# Altium project Steering.PrjPcb (part 1 of 2)
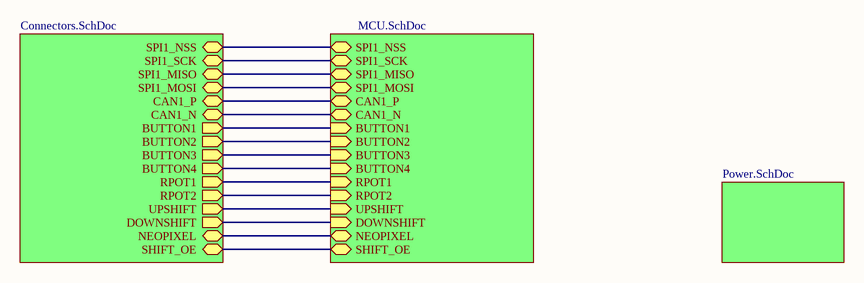
[diagram p0: TOP.SchDoc]
6 sheets, 62 parts. Net scope: hierarchical (ports join the sheet entries above them; power ports are global).
Board file: PCB.pcbdoc
Sheets:
  TOP.SchDoc
    Power = Power.SchDoc
    MCU = MCU.SchDoc
      CAN = CAN.SchDoc
    Connectors = Connectors.SchDoc
      Neopixel = Neopixel.SchDoc

## Sheet TOP.SchDoc: =DocumentName
size A4; Organization: Queen's Formula SAE; Address1: 130 Stuart St, Kingston; Address2: Ontario; Address3: Canada; Address4: K7L 2V9; DocumentNumber: 1; Revision: 0; SheetNumber: 1; SheetTotal: 1

### Sub-sheets
Connectors = Connectors.SchDoc: SPI1_NSS (bidir), SPI1_SCK (bidir), SPI1_MISO (bidir), SPI1_MOSI (bidir), CAN1_P (bidir), CAN1_N (bidir), BUTTON1 (out), BUTTON2 (out), BUTTON3 (out), BUTTON4 (out), RPOT1 (out), RPOT2 (out), UPSHIFT (out), DOWNSHIFT (out), NEOPIXEL (bidir), SHIFT_OE (bidir)
MCU = MCU.SchDoc: SPI1_NSS (bidir), SPI1_SCK (bidir), SPI1_MISO (bidir), SPI1_MOSI (bidir), CAN1_P (bidir), CAN1_N (bidir), BUTTON1 (in), BUTTON2 (in), BUTTON3 (in), BUTTON4 (in), RPOT1 (in), RPOT2 (in), UPSHIFT (in), DOWNSHIFT (in), NEOPIXEL (bidir), SHIFT_OE (bidir)
Power = Power.SchDoc: no entries

### Nets
BUTTON1: sheet MCU/BUTTON1, sheet Connectors/BUTTON1
BUTTON2: sheet MCU/BUTTON2, sheet Connectors/BUTTON2
BUTTON3: sheet MCU/BUTTON3, sheet Connectors/BUTTON3
BUTTON4: sheet MCU/BUTTON4, sheet Connectors/BUTTON4
CAN1_N: sheet MCU/CAN1_N, sheet Connectors/CAN1_N
CAN1_P: sheet MCU/CAN1_P, sheet Connectors/CAN1_P
DOWNSHIFT: sheet MCU/DOWNSHIFT, sheet Connectors/DOWNSHIFT
NEOPIXEL: sheet MCU/NEOPIXEL, sheet Connectors/NEOPIXEL
RPOT1: sheet MCU/RPOT1, sheet Connectors/RPOT1
RPOT2: sheet MCU/RPOT2, sheet Connectors/RPOT2
SHIFT_OE: sheet MCU/SHIFT_OE, sheet Connectors/SHIFT_OE
SPI1_MISO: sheet MCU/SPI1_MISO, sheet Connectors/SPI1_MISO
SPI1_MOSI: sheet MCU/SPI1_MOSI, sheet Connectors/SPI1_MOSI
SPI1_NSS: sheet MCU/SPI1_NSS, sheet Connectors/SPI1_NSS
SPI1_SCK: sheet MCU/SPI1_SCK, sheet Connectors/SPI1_SCK
UPSHIFT: sheet MCU/UPSHIFT, sheet Connectors/UPSHIFT

### Notes on the sheet
- Title
- Size:
- Date:
- A4
- Number:
- Time:
- Revision:
- Sheet
- of
- File:

## Sheet Power.SchDoc: =DocumentName
size A4; Organization: Queen's Formula SAE; Address1: 130 Stuart St, Kingston; Address2: Ontario; Address3: Canada; Address4: K7L 2V9; DocumentNumber: 1; Revision: 0; SheetNumber: 1; SheetTotal: 1
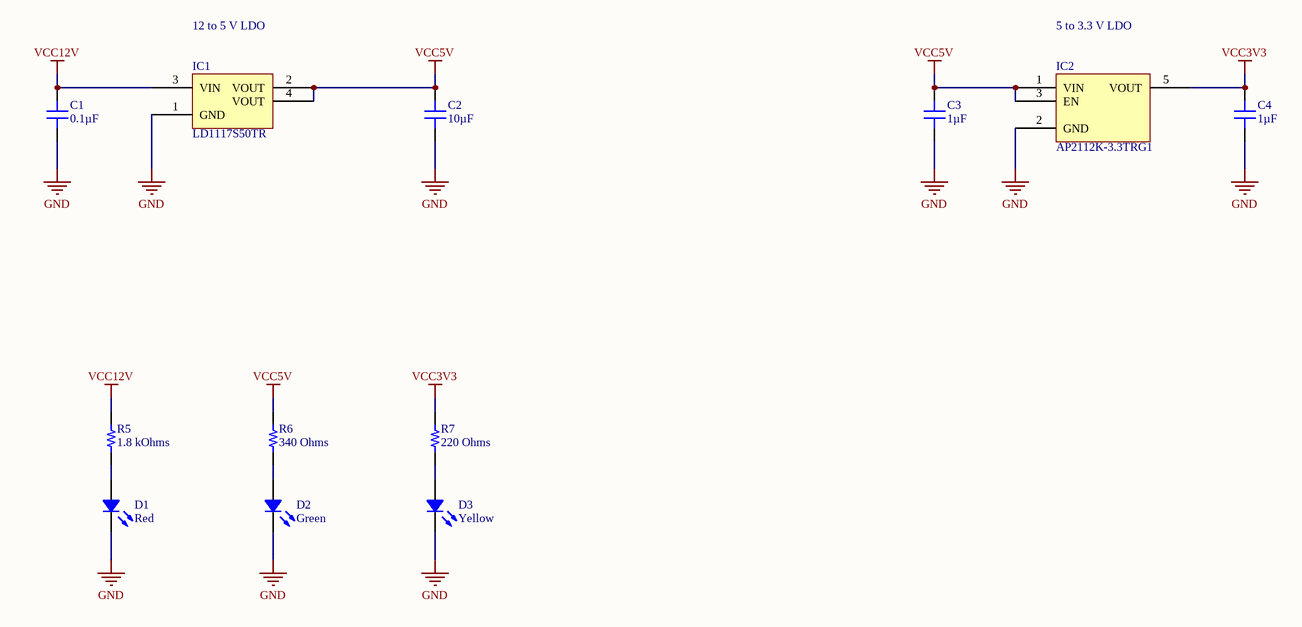
[diagram p1: Power.SchDoc]

### Parts
C1  0.1µF  [CAP 0402_1005]
C2  10µF  [CAP 0805_2012]
C3  1µF  [CAP 0402_1005]
C4  1µF  [CAP 0402_1005]
D1  Red  [LED 0603_1608 RED]
D2  Green  [LED 0402_1005 GREEN]
D3  Yellow  [LED 0402_1005 YELLOW]
IC1  LD1117S50TR  [ST SOT-223]
IC2  AP2112K-3.3TRG1  [DIODES SOT-23-5 W5]
R5  1.8 kOhms  [RES 0402_1005]
R6  340 Ohms  [RES 0402_1005]
R7  220 Ohms  [RES 0402_1005]

### Nets
GND: C1.1 C2.1 C3.1 C4.1 D1.2 D2.2 D3.2 IC1.1(GND) IC2.2(GND)
VCC3V3: C4.2 IC2.5(VOUT) R7.2
VCC5V: C2.2 C3.2 IC1.2(VOUT) IC1.4(VOUT) IC2.1(VIN) IC2.3(EN) R6.2
VCC12V: C1.2 IC1.3(VIN) R5.1
NetD1_1: D1.1 R5.2
NetD2_1: D2.1 R6.1
NetD3_1: D3.1 R7.1

### Notes on the sheet
- 12 to 5 V LDO
- 5 to 3.3 V LDO
- Title
- Size:
- Date:
- A4
- Number:
- Time:
- Revision:
- Sheet
- of
- File:

### Library data of the parts
C1 = CGA2B3X5R1H104M050BB: CAP CER 0.1UF 50V X5R 0402; Manufacturer: TDK Corporation; Tolerance: ±20%; Part Number: CGA2B3X5R1H104M050BB; Value: 0.1µF; Applications: Automotive; Capacitance: 0.1µF; ComponentLink1Description: Datasheet; ComponentLink1URL: https://product.tdk.com/info/en/catalog/datasheets/mlcc_automotive_general_en.pdf?ref_disty=digikey; ComponentLink2Description: DigiKey Link; ComponentLink2URL: http://digikey.com/product-detail/en/tdk-corporation/CGA2B3X5R1H104M050BB/445-12214-1-ND/3953880; Device Package: 0402 (1005 Metric); LastUpdated: 2020-09-02 1:02:25 AM; Lifecycle Status: Active; Minimum Order: 1; Mounting Type: Surface Mount, MLCC; Operating Temperature: -55°C ~ 85°C; Package / Case: 0402 (1005 Metric); Packaging: TapeAndReel; PartId: 1792; Part Status: Active; Price: 0.02; Ratings: AEC-Q200; Series: CGA; Size / Dimension: 0.039" L x 0.020" W (1.00mm x 0.50mm); Supplier 1: DigiKey; Supplier Part Number 1: 445-12214-1-ND; Temperature Coefficient: X5R; Thickness (Max): 0.022" (0.55mm); Voltage - Rated: 50V
C2 = GRM21BC81E106ME51L: CAP CER 10UF 25V X6S 0805; Manufacturer: Murata Electronics; Tolerance: ±20%; Part Number: GRM21BC81E106ME51L; Value: 10µF; Applications: General Purpose; Capacitance: 10µF; ComponentLink1Description: Datasheet; ComponentLink1URL: https://search.murata.co.jp/Ceramy/image/img/A01X/G101/ENG/GRM21BC81E106ME51-01.pdf; ComponentLink2Description: DigiKey Link; ComponentLink2URL: http://digikey.com/product-detail/en/murata-electronics/GRM21BC81E106ME51L/490-10503-1-ND/5026431; Device Package: 0805 (2012 Metric); LastUpdated: 2020-09-02 1:04:38 AM; Lifecycle Status: Active; Minimum Order: 1; Mounting Type: Surface Mount, MLCC; Operating Temperature: -55°C ~ 105°C; Package / Case: 0805 (2012 Metric); Packaging: TapeAndReel; PartId: 4560; Part Status: Active; Price: 0.07; Series: GRM; Size / Dimension: 0.079" L x 0.049" W (2.00mm x 1.25mm); Supplier 1: DigiKey; Supplier Part Number 1: 490-10503-1-ND; Temperature Coefficient: X6S; Thickness (Max): 0.055" (1.40mm); Voltage - Rated: 25V
C3 C4 = 0402ZD105KAT4A: CAP CER 1UF 10V X5R 0402; Manufacturer: AVX Corporation; Tolerance: ±10%; Part Number: 0402ZD105KAT4A; Value: 1µF; Applications: General Purpose; Capacitance: 1µF; ComponentLink1Description: Datasheet; ComponentLink1URL: http://datasheets.avx.com/cx5r.pdf; ComponentLink2Description: DigiKey Link; ComponentLink2URL: http://digikey.com/product-detail/en/avx-corporation/0402ZD105KAT4A/478-10063-1-ND/6564285; Device Package: 0402 (1005 Metric); LastUpdated: 2020-09-02 1:02:25 AM; Lifecycle Status: Active; Minimum Order: 1; Mounting Type: Surface Mount, MLCC; Operating Temperature: -55°C ~ 85°C; Package / Case: 0402 (1005 Metric); Packaging: TapeAndReel; PartId: 1846; Part Status: Active; Price: 0.02; Series: -; Size / Dimension: 0.039" L x 0.020" W (1.00mm x 0.50mm); Supplier 1: DigiKey; Supplier Part Number 1: 478-10063-1-ND; Temperature Coefficient: X5R; Thickness (Max): 0.022" (0.56mm); Voltage - Rated: 10V
D1 = SML-LXIL0603SIC-TR: 1.64X0.84X1.15MM TOP VIEW SMT LE; Manufacturer: Lumex Opto/Components Inc.; Current - Test: 20mA; Lens Color: Colorless; Lens Size: 0.79mm Dia; Lens Style: Round with Domed Top; Lens Transparency: Clear; Millicandela Rating: 1600mcd; Viewing Angle: 75°; Voltage - Forward (Vf) (Typ): 2.1V; Wavelength - Peak: 630nm; Part Number: SML-LXIL0603SIC-TR; Color: Red; ComponentLink1Description: Datasheet; ComponentLink1URL: https://www.lumex.com/spec/SML-LXIL0603SIC-TR.pdf; ComponentLink2Description: DigiKey Link; ComponentLink2URL: http://digikey.com/product-detail/en/lumex-opto-components-inc/SML-LXIL0603SIC-TR/67-2333-1-ND/9866812; Device Package: 0603 (1608 Metric); Height (Max): 1.40mm; LastUpdated: 2020-09-02 1:20:56 AM; Lifecycle Status: Active; Minimum Order: 1; Mounting Type: Surface Mount; Package / Case: 0603 (1608 Metric); Packaging: TapeAndReel; PartId: 406; Part Status: Active; Price: 0.19; Series: -; Size / Dimension: 1.64mm L x 0.84mm W; Supplier 1: DigiKey; Supplier Part Number 1: 67-2333-1-ND; Value: Red
D2 = EAST10052GA0: LED GREEN CLEAR 2SMD; Manufacturer: Everlight Electronics Co Ltd; Configuration: Standard; Current - Test: 5mA; Lens Color: Colorless; Lens Size: 1.00mm x 0.50mm; Lens Style: Rectangle with Flat Top; Viewing Angle: 120°; Voltage - Forward (Vf) (Typ): 2.95V; Wavelength - Peak: 518nm; Part Number: EAST10052GA0; Color: Green; ComponentLink1Description: Datasheet; ComponentLink1URL: https://everlightamericas.com/index.php?controller=attachment&id_attachment=3256; ComponentLink2Description: DigiKey Link; ComponentLink2URL: http://digikey.com/product-detail/en/everlight-electronics-co-ltd/EAST10052GA0/1080-1557-1-ND/8510385; Device Package: 0402 (1005 Metric); Height (Max): 0.25mm; LastUpdated: 2020-09-02 1:20:38 AM; Lens Transparency: Clear; Lifecycle Status: Active; Minimum Order: 1; Mounting Type: Surface Mount; Package / Case: 0402 (1005 Metric); Packaging: TapeAndReel; PartId: 696; Part Status: Active; Price: 0.08; Series: -; Size / Dimension: 1.00mm L x 0.50mm W; Supplier 1: DigiKey; Supplier Part Number 1: 1080-1557-1-ND; Supplier Device Package: 2-SMD; Value: Green
D3 = APG1005SYC-T: LED YELLOW CLEAR CHIP SMD; Manufacturer: Kingbright; Configuration: Standard; Current - Test: 20mA; Lens Color: Colorless; Lens Size: 0.60mm x 0.50mm; Lens Style: Rectangle with Flat Top; Millicandela Rating: 100mcd; Viewing Angle: 120°; Voltage - Forward (Vf) (Typ): 2.05V; Wavelength - Dominant: 589nm; Wavelength - Peak: 591nm; Part Number: APG1005SYC-T; Color: Yellow; ComponentLink1Description: Datasheet; ComponentLink1URL: http://www.kingbrightusa.com/images/catalog/SPEC/APG1005SYC-T.pdf; ComponentLink2Description: DigiKey Link; ComponentLink2URL: http://digikey.com/product-detail/en/kingbright/APG1005SYC-T/754-1809-1-ND/4764945; Device Package: 0402 (1005 Metric); Height (Max): 0.25mm; LastUpdated: 2020-09-02 1:21:13 AM; Lens Transparency: Clear; Lifecycle Status: Active; Minimum Order: 1; Mounting Type: Surface Mount; Package / Case: 0402 (1005 Metric); Packaging: TapeAndReel; PartId: 173; Part Status: Active; Price: 0.10; Series: -; Size / Dimension: 1.00mm L x 0.50mm W; Supplier 1: DigiKey; Supplier Part Number 1: 754-1809-1-ND; Supplier Device Package: Chip LED; Value: Yellow
IC1 = LD1117S50TR: IC REG LINEAR 5V 800MA SOT223; Manufacturer: STMicroelectronics; Current - Quiescent (Iq): 10mA; Number of Regulators: 1; Output Configuration: Positive; Output Type: Fixed; Protection Features: Over Current, Over Temperature; PSRR: 75dB (120Hz); Voltage Dropout (Max): 1.2V @ 800mA; Voltage - Input (Max): 15V; Part Number: LD1117S50TR; ComponentLink1Description: Datasheet; ComponentLink1URL: http://www.st.com/content/ccc/resource/technical/document/datasheet/99/3b/7d/91/91/51/4b/be/CD00000544.pdf/files/CD00000544.pdf/jcr:content/translations/en.CD00000544.pdf; ComponentLink2Description: DigiKey Link; ComponentLink2URL: http://digikey.com/product-detail/en/stmicroelectronics/LD1117S50TR/497-6447-1-ND/1865475; Current - Output: 800mA; LastUpdated: 2020-09-02 1:24:39 AM; Lifecycle Status: Active; Minimum Order: 1; Mounting Type: Surface Mount; Package / Case: TO-261-4, TO-261AA; Packaging: TapeAndReel; Part Status: Active; Price: 0.14; Series: -; Supplier 1: DigiKey; Supplier Part Number 1: 497-6447-1-ND; Supplier Device Package: SOT-223; Voltage - Output (Min/Fixed): 5V
IC2 = AP2112K-3.3TRG1: IC REG LINEAR 3.3V 600MA SOT25; Manufacturer: Diodes Incorporated; Control Features: Enable; Current - Quiescent (Iq): 80µA; Number of Regulators: 1; Output Configuration: Positive; Output Type: Fixed; Protection Features: Over Current, Over Temperature; PSRR: 65sB (100Hz ~ 1KHz); Voltage Dropout (Max): 0.4V @ 600mA; Voltage - Input (Max): 6V; Part Number: AP2112K-3.3TRG1; ComponentLink1Description: Datasheet; ComponentLink1URL: https://www.diodes.com/assets/Datasheets/AP2112.pdf; ComponentLink2Description: DigiKey Link; ComponentLink2URL: http://digikey.com/product-detail/en/diodes-incorporated/AP2112K-3.3TRG1/AP2112K-3.3TRG1DICT-ND/4505257; Current - Output: 600mA; LastUpdated: 2020-09-02 1:25:56 AM; Lifecycle Status: Active; Minimum Order: 1; Mounting Type: Surface Mount; Operating Temperature: -40°C ~ 85°C; Package / Case: SC-74A, SOT-753; Packaging: TapeAndReel; Part Status: Active; Price: 0.10; Series: -; Supplier 1: DigiKey; Supplier Part Number 1: AP2112K-3.3TRG1DICT-ND; Supplier Device Package: SOT-25; Voltage - Output (Min/Fixed): 3.3V
R5 = CR0402-FX-1801GLF: RES SMD 1.8K OHM 1% 1/16W 0402; Manufacturer: Bourns Inc.; Power (Watts): 0.063W, 1/16W; Temperature Coefficient: ±100ppm/°C; Part Number: CR0402-FX-1801GLF; Value: 1.8 kOhms; ComponentLink1Description: Datasheet; ComponentLink1URL: https://www.bourns.com/docs/Product-Datasheets/CR0402.pdf; ComponentLink2Description: DigiKey Link; ComponentLink2URL: http://digikey.com/product-detail/en/bourns-inc/CR0402-FX-1801GLF/CR0402-FX-1801GLFCT-ND/8601850; Composition: Thick Film; Device Package: 0402 (1005 Metric); Height - Seated (Max): 0.016" (0.40mm); LastUpdated: 2020-09-02 1:07:48 AM; Lifecycle Status: Active; Minimum Order: 1; Number of Terminations: 2; Operating Temperature: -55°C ~ 155°C; Package / Case: 0402 (1005 Metric); Packaging: TapeAndReel; PartId: 12865; Part Status: Active; Price: 0.01; Resistance: 1.8 kOhms; Series: CR0402; Size / Dimension: 0.039" L x 0.020" W (1.00mm x 0.50mm); Supplier 1: DigiKey; Supplier Part Number 1: CR0402-FX-1801GLFCT-ND; Supplier Device Package: 0402; Tolerance: ±1%
R6 = ERJ-2RKF3400X: RES SMD 340 OHM 1% 1/10W 0402; Manufacturer: Panasonic Electronic Components; Power (Watts): 0.1W, 1/10W; Temperature Coefficient: ±100ppm/°C; Part Number: ERJ-2RKF3400X; Value: 340 Ohms; ComponentLink1Description: Datasheet; ComponentLink1URL: https://industrial.panasonic.com/cdbs/www-data/pdf/RDA0000/AOA0000C304.pdf; ComponentLink2Description: DigiKey Link; ComponentLink2URL: http://digikey.com/product-detail/en/panasonic-electronic-components/ERJ-2RKF3400X/P340LCT-ND/194355; Composition: Thick Film; Device Package: 0402 (1005 Metric); Features: Automotive AEC-Q200; Height - Seated (Max): 0.016" (0.40mm); LastUpdated: 2020-09-02 1:07:26 AM; Lifecycle Status: Active; Minimum Order: 1; Number of Terminations: 2; Operating Temperature: -55°C ~ 155°C; Package / Case: 0402 (1005 Metric); Packaging: CutTape; PartId: 21290; Part Status: Active; Price: 0.10; Ratings: AEC-Q200; Resistance: 340 Ohms; Series: ERJ; Size / Dimension: 0.039" L x 0.020" W (1.00mm x 0.50mm); Supplier 1: DigiKey; Supplier Part Number 1: P340LCT-ND; Supplier Device Package: 0402; Tolerance: ±1%
R7 = CRGCQ0402J220R: CRGCQ 0402 220R 5%; Manufacturer: TE Connectivity Passive Product; Power (Watts): 0.063W, 1/16W; Temperature Coefficient: ±100ppm/°C; Part Number: CRGCQ0402J220R; Value: 220 Ohms; ComponentLink1Description: Datasheet; ComponentLink1URL: https://www.te.com/commerce/DocumentDelivery/DDEController?Action=srchrtrv&DocNm=1773204-3&DocType=DS&DocLang=English; ComponentLink2Description: DigiKey Link; ComponentLink2URL: http://digikey.com/product-detail/en/te-connectivity-passive-product/CRGCQ0402J220R/A130044CT-ND/8577876; Composition: Thick Film; Device Package: 0402 (1005 Metric); Features: Automotive AEC-Q200, Moisture Resistant; Height - Seated (Max): 0.016" (0.40mm); LastUpdated: 2020-09-02 1:07:58 AM; Lifecycle Status: Active; Minimum Order: 1; Number of Terminations: 2; Operating Temperature: -55°C ~ 155°C; Package / Case: 0402 (1005 Metric); Packaging: CutTape; PartId: 8030; Part Status: Active; Price: 0.10; Ratings: AEC-Q200; Resistance: 220 Ohms; Series: CRGCQ; Size / Dimension: 0.039" L x 0.020" W (1.00mm x 0.50mm); Supplier 1: DigiKey; Supplier Part Number 1: A130044CT-ND; Supplier Device Package: 0402; Tolerance: ±5%

## Sheet MCU.SchDoc: =DocumentName
size A4; Organization: Queen's Formula SAE; Address1: 130 Stuart St, Kingston; Address2: Ontario; Address3: Canada; Address4: K7L 2V9; DocumentNumber: 1; Revision: 0; SheetNumber: 1; SheetTotal: 1
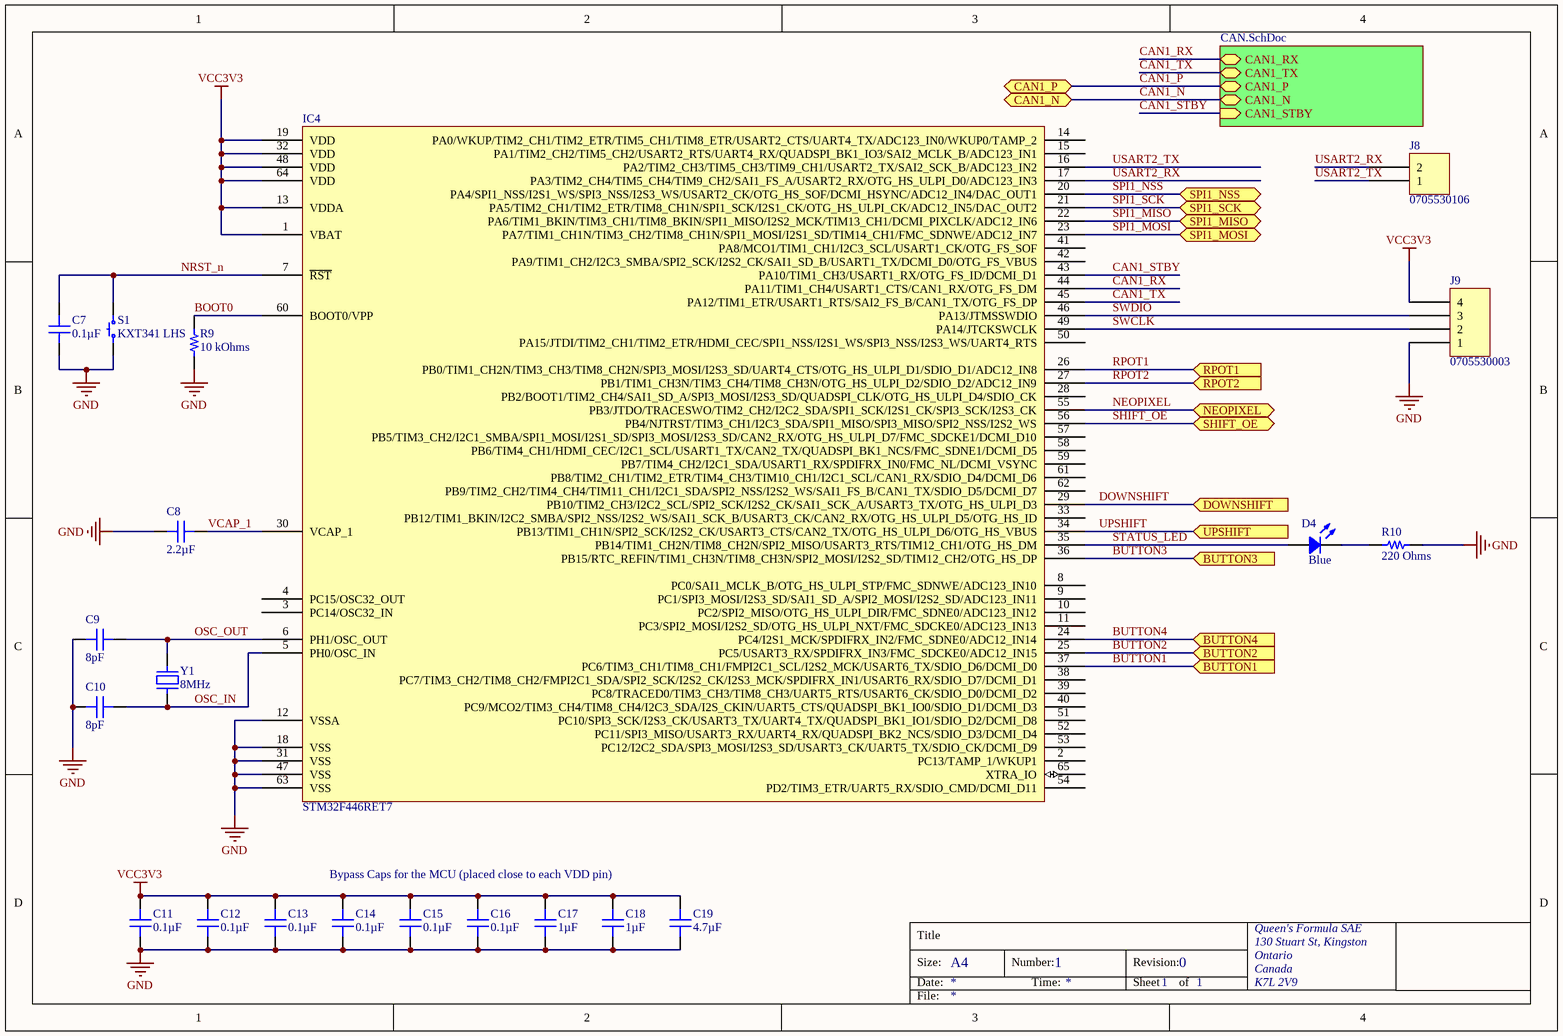
[diagram p2: MCU.SchDoc]

### Parts
C7  0.1µF  [CAP 0402_1005]
C8  2.2µF  [CAP 0402_1005]
C9  8pF  [CAP 0402_1005]
C10  8pF  [CAP 0402_1005]
C11  0.1µF  [CAP 0402_1005]
C12  0.1µF  [CAP 0402_1005]
C13  0.1µF  [CAP 0402_1005]
C14  0.1µF  [CAP 0402_1005]
C15  0.1µF  [CAP 0402_1005]
C16  0.1µF  [CAP 0402_1005]
C17  1µF  [CAP 0402_1005]
C18  1µF  [CAP 0402_1005]
C19  4.7µF  [CAP 0402_1005]
D4  Blue  [LED 0402_1005 BLUE]
IC4  STM32F446RET7  [ST LQFP-64 10X10MM]
J8  0705530106  [MOLEX SDA-70553-2PIN]
J9  0705530003  [MOLEX SDA-70553-4PIN]
R9  10 kOhms  [RES 0402_1005]
R10  220 Ohms  [RES 0402_1005]
S1  KXT341 LHS  [C&K KXT3]
Y1  8MHz  [NDK NX3225GD]

### Sub-sheets
CAN = CAN.SchDoc: CAN1_RX (bidir), CAN1_TX (bidir), CAN1_STBY (in), CAN1_P (bidir), CAN1_N (bidir)

### Ports
BUTTON1 (in), BUTTON2 (in), BUTTON3 (in), BUTTON4 (in), CAN1_N (bidir), CAN1_P (bidir), DOWNSHIFT (in), NEOPIXEL (bidir), RPOT1 (in), RPOT2 (in), SHIFT_OE (bidir), SPI1_MISO (bidir), SPI1_MOSI (bidir), SPI1_NSS (bidir), SPI1_SCK (bidir), UPSHIFT (in)

### Nets
GND: C7.1 C8.2 C9.1 C10.1 C11.1 C12.1 C13.1 C14.1 C15.1 C16.1 C17.1 C18.1 C19.1 IC4.12(VSSA) IC4.18(VSS) IC4.31(VSS) IC4.47(VSS) IC4.63(VSS) J9.1 R9.1 R10.2 S1.1
VCC3V3: C11.2 C12.2 C13.2 C14.2 C15.2 C16.2 C17.2 C18.2 C19.2 IC4.1(VBAT) IC4.13(VDDA) IC4.19(VDD) IC4.32(VDD) IC4.48(VDD) IC4.64(VDD) J9.4
BOOT0: IC4.60(BOOT0/VPP) R9.2
BUTTON1: IC4.37(PC6/TIM3_CH1/TIM8_CH1/FMPI2C1_SCL/I2S2_MCK/USART6_TX/SDIO_D6/DCMI_D0) ; port BUTTON1
BUTTON2: IC4.25(PC5/USART3_RX/SPDIFRX_IN3/FMC_SDCKE0/ADC12_IN15) ; port BUTTON2
BUTTON3: IC4.36(PB15/RTC_REFIN/TIM1_CH3N/TIM8_CH3N/SPI2_MOSI/I2S2_SD/TIM12_CH2/OTG_HS_DP) ; port BUTTON3
BUTTON4: IC4.24(PC4/I2S1_MCK/SPDIFRX_IN2/FMC_SDNE0/ADC12_IN14) ; port BUTTON4
CAN1_N: port CAN1_N, sheet CAN/CAN1_N
CAN1_P: port CAN1_P, sheet CAN/CAN1_P
CAN1_RX: IC4.44(PA11/TIM1_CH4/USART1_CTS/CAN1_RX/OTG_FS_DM) ; sheet CAN/CAN1_RX
CAN1_STBY: IC4.43(PA10/TIM1_CH3/USART1_RX/OTG_FS_ID/DCMI_D1) ; sheet CAN/CAN1_STBY
CAN1_TX: IC4.45(PA12/TIM1_ETR/USART1_RTS/SAI2_FS_B/CAN1_TX/OTG_FS_DP) ; sheet CAN/CAN1_TX
DOWNSHIFT: IC4.29(PB10/TIM2_CH3/I2C2_SCL/SPI2_SCK/I2S2_CK/SAI1_SCK_A/USART3_TX/OTG_HS_ULPI_D3) ; port DOWNSHIFT
NEOPIXEL: IC4.55(PB3/JTDO/TRACESWO/TIM2_CH2/I2C2_SDA/SPI1_SCK/I2S1_CK/SPI3_SCK/I2S3_CK) ; port NEOPIXEL
NRST_n: C7.2 IC4.7(~{RST}) S1.2
OSC_IN: C10.2 IC4.5(PH0/OSC_IN) Y1.1
OSC_OUT: C9.2 IC4.6(PH1/OSC_OUT) Y1.2
RPOT1: IC4.26(PB0/TIM1_CH2N/TIM3_CH3/TIM8_CH2N/SPI3_MOSI/I2S3_SD/UART4_CTS/OTG_HS_ULPI_D1/SDIO_D1/ADC12_IN8) ; port RPOT1
RPOT2: IC4.27(PB1/TIM1_CH3N/TIM3_CH4/TIM8_CH3N/OTG_HS_ULPI_D2/SDIO_D2/ADC12_IN9) ; port RPOT2
SHIFT_OE: IC4.56(PB4/NJTRST/TIM3_CH1/I2C3_SDA/SPI1_MISO/SPI3_MISO/SPI2_NSS/I2S2_WS) ; port SHIFT_OE
SPI1_MISO: IC4.22(PA6/TIM1_BKIN/TIM3_CH1/TIM8_BKIN/SPI1_MISO/I2S2_MCK/TIM13_CH1/DCMI_PIXCLK/ADC12_IN6) ; port SPI1_MISO
SPI1_MOSI: IC4.23(PA7/TIM1_CH1N/TIM3_CH2/TIM8_CH1N/SPI1_MOSI/I2S1_SD/TIM14_CH1/FMC_SDNWE/ADC12_IN7) ; port SPI1_MOSI
SPI1_NSS: IC4.20(PA4/SPI1_NSS/I2S1_WS/SPI3_NSS/I2S3_WS/USART2_CK/OTG_HS_SOF/DCMI_HSYNC/ADC12_IN4/DAC_OUT1) ; port SPI1_NSS
SPI1_SCK: IC4.21(PA5/TIM2_CH1/TIM2_ETR/TIM8_CH1N/SPI1_SCK/I2S1_CK/OTG_HS_ULPI_CK/ADC12_IN5/DAC_OUT2) ; port SPI1_SCK
STATUS_LED: D4.1 IC4.35(PB14/TIM1_CH2N/TIM8_CH2N/SPI2_MISO/USART3_RTS/TIM12_CH1/OTG_HS_DM)
SWCLK: IC4.49(PA14/JTCKSWCLK) J9.2
SWDIO: IC4.46(PA13/JTMSSWDIO) J9.3
UPSHIFT: IC4.34(PB13/TIM1_CH1N/SPI2_SCK/I2S2_CK/USART3_CTS/CAN2_TX/OTG_HS_ULPI_D6/OTG_HS_VBUS) ; port UPSHIFT
USART2_RX: IC4.17(PA3/TIM2_CH4/TIM5_CH4/TIM9_CH2/SAI1_FS_A/USART2_RX/OTG_HS_ULPI_D0/ADC123_IN3) J8.2
USART2_TX: IC4.16(PA2/TIM2_CH3/TIM5_CH3/TIM9_CH1/USART2_TX/SAI2_SCK_B/ADC123_IN2) J8.1
VCAP_1: C8.1 IC4.30(VCAP_1)
NetD4_2: D4.2 R10.1

Not connected (* = marked no-connect by the designer): IC4 2(PC13/TAMP_1/WKUP1) 3(PC14/OSC32_IN) 4(PC15/OSC32_OUT) 8(PC0/SAI1_MCLK_B/OTG_HS_ULPI_STP/FMC_SDNWE/ADC123_IN10) 9(PC1/SPI3_MOSI/I2S3_SD/SAI1_SD_A/SPI2_MOSI/I2S2_SD/ADC123_IN11) 10(PC2/SPI2_MISO/OTG_HS_ULPI_DIR/FMC_SDNE0/ADC123_IN12) 11(PC3/SPI2_MOSI/I2S2_SD/OTG_HS_ULPI_NXT/FMC_SDCKE0/ADC123_IN13) 14(PA0/WKUP/TIM2_CH1/TIM2_ETR/TIM5_CH1/TIM8_ETR/USART2_CTS/UART4_TX/ADC123_IN0/WKUP0/TAMP_2) 15(PA1/TIM2_CH2/TIM5_CH2/USART2_RTS/UART4_RX/QUADSPI_BK1_IO3/SAI2_MCLK_B/ADC123_IN1) 28(PB2/BOOT1/TIM2_CH4/SAI1_SD_A/SPI3_MOSI/I2S3_SD/QUADSPI_CLK/OTG_HS_ULPI_D4/SDIO_CK) 33(PB12/TIM1_BKIN/I2C2_SMBA/SPI2_NSS/I2S2_WS/SAI1_SCK_B/USART3_CK/CAN2_RX/OTG_HS_ULPI_D5/OTG_HS_ID) 38(PC7/TIM3_CH2/TIM8_CH2/FMPI2C1_SDA/SPI2_SCK/I2S2_CK/I2S3_MCK/SPDIFRX_IN1/USART6_RX/SDIO_D7/DCMI_D1) 39(PC8/TRACED0/TIM3_CH3/TIM8_CH3/UART5_RTS/USART6_CK/SDIO_D0/DCMI_D2) 40(PC9/MCO2/TIM3_CH4/TIM8_CH4/I2C3_SDA/I2S_CKIN/UART5_CTS/QUADSPI_BK1_IO0/SDIO_D1/DCMI_D3) 41(PA8/MCO1/TIM1_CH1/I2C3_SCL/USART1_CK/OTG_FS_SOF) 42(PA9/TIM1_CH2/I2C3_SMBA/SPI2_SCK/I2S2_CK/SAI1_SD_B/USART1_TX/DCMI_D0/OTG_FS_VBUS) 50(PA15/JTDI/TIM2_CH1/TIM2_ETR/HDMI_CEC/SPI1_NSS/I2S1_WS/SPI3_NSS/I2S3_WS/UART4_RTS) 51(PC10/SPI3_SCK/I2S3_CK/USART3_TX/UART4_TX/QUADSPI_BK1_IO1/SDIO_D2/DCMI_D8) 52(PC11/SPI3_MISO/USART3_RX/UART4_RX/QUADSPI_BK2_NCS/SDIO_D3/DCMI_D4) 53(PC12/I2C2_SDA/SPI3_MOSI/I2S3_SD/USART3_CK/UART5_TX/SDIO_CK/DCMI_D9) 54(PD2/TIM3_ETR/UART5_RX/SDIO_CMD/DCMI_D11) 57(PB5/TIM3_CH2/I2C1_SMBA/SPI1_MOSI/I2S1_SD/SPI3_MOSI/I2S3_SD/CAN2_RX/OTG_HS_ULPI_D7/FMC_SDCKE1/DCMI_D10) 58(PB6/TIM4_CH1/HDMI_CEC/I2C1_SCL/USART1_TX/CAN2_TX/QUADSPI_BK1_NCS/FMC_SDNE1/DCMI_D5) 59(PB7/TIM4_CH2/I2C1_SDA/USART1_RX/SPDIFRX_IN0/FMC_NL/DCMI_VSYNC) 61(PB8/TIM2_CH1/TIM2_ETR/TIM4_CH3/TIM10_CH1/I2C1_SCL/CAN1_RX/SDIO_D4/DCMI_D6) 62(PB9/TIM2_CH2/TIM4_CH4/TIM11_CH1/I2C1_SDA/SPI2_NSS/I2S2_WS/SAI1_FS_B/CAN1_TX/SDIO_D5/DCMI_D7) 65(XTRA_IO)

### Notes on the sheet
- Bypass Caps for the MCU (placed close to each VDD pin)
- Title
- Size:
- Date:
- A4
- Number:
- Time:
- Revision:
- Sheet
- of
- File:

### Library data of the parts
C7 C11-C16 = C0402C104K4RECAUTO: CAP CER 0402 0.1UF 16V X7R 10%; Manufacturer: KEMET; Part Number: C0402C104K4RECAUTO; Value: 0.1µF; Applications: Automotive, ESD Protection; Capacitance: 0.1µF; ComponentLink1Description: Datasheet; ComponentLink1URL: https://api.kemet.com/component-edge/download/datasheet/C0402C104K4RECAUTO.pdf; ComponentLink2Description: DigiKey Link; ComponentLink2URL: http://digikey.com/product-detail/en/kemet/C0402C104K4RECAUTO/399-17167-1-ND/8563708; Device Package: 0402 (1005 Metric); LastUpdated: 2020-09-02 1:02:25 AM; Lifecycle Status: Active; Minimum Order: 1; Mounting Type: Surface Mount, MLCC; Operating Temperature: -55°C ~ 125°C; Package / Case: 0402 (1005 Metric); Packaging: TapeAndReel; PartId: 1731; Part Status: Active; Price: 0.02; Series: ESD SMD Auto X7R; Size / Dimension: 0.039" L x 0.020" W (1.00mm x 0.50mm); Supplier 1: DigiKey; Supplier Part Number 1: 399-17167-1-ND; Temperature Coefficient: X7R; Thickness (Max): 0.022" (0.55mm); Tolerance: ±10%; Voltage - Rated: 16V; Ratings: AEC-Q200
C8 = CL05A225KO5NQNC: CAP CER 2.2UF 16V X5R 0402; Manufacturer: Samsung Electro-Mechanics; Tolerance: ±10%; Part Number: CL05A225KO5NQNC; Value: 2.2µF; Applications: General Purpose; Capacitance: 2.2µF; ComponentLink1Description: Datasheet; ComponentLink1URL: http://www.samsungsem.com/kr/support/product-search/mlcc/CL05A225KO5NQNC.jsp; ComponentLink2Description: DigiKey Link; ComponentLink2URL: http://digikey.com/product-detail/en/samsung-electro-mechanics/CL05A225KO5NQNC/1276-1461-1-ND/3889547; Device Package: 0402 (1005 Metric); LastUpdated: 2020-09-02 1:02:25 AM; Lifecycle Status: Active; Minimum Order: 1; Mounting Type: Surface Mount, MLCC; Operating Temperature: -55°C ~ 85°C; Package / Case: 0402 (1005 Metric); Packaging: TapeAndReel; PartId: 1761; Part Status: Active; Price: 0.10; Series: CL; Size / Dimension: 0.039" L x 0.020" W (1.00mm x 0.50mm); Supplier 1: DigiKey; Supplier Part Number 1: 1276-1461-1-ND; Temperature Coefficient: X5R; Thickness (Max): 0.022" (0.55mm); Voltage - Rated: 16V
C9 C10 = C1005NP01H080D050BA: CAP CER 8PF 50V NP0 0402; Manufacturer: TDK Corporation; Temperature Coefficient: C0G, NP0; Tolerance: ±0.5pF; Part Number: C1005NP01H080D050BA; Value: 8pF; Applications: General Purpose; Capacitance: 8pF; ComponentLink1Description: Datasheet; ComponentLink1URL: https://product.tdk.com/info/en/catalog/datasheets/mlcc_commercial_hightemp_en.pdf?ref_disty=digikey; ComponentLink2Description: DigiKey Link; ComponentLink2URL: http://digikey.com/product-detail/en/tdk-corporation/C1005NP01H080D050BA/445-13781-1-ND/3955447; Device Package: 0402 (1005 Metric); Features: High Temperature; LastUpdated: 2020-09-02 1:02:24 AM; Lifecycle Status: Active; Minimum Order: 1; Mounting Type: Surface Mount, MLCC; Operating Temperature: -55°C ~ 150°C; Package / Case: 0402 (1005 Metric); Packaging: TapeAndReel; PartId: 2033; Part Status: Active; Price: 0.01; Series: C; Size / Dimension: 0.039" L x 0.020" W (1.00mm x 0.50mm); Supplier 1: DigiKey; Supplier Part Number 1: 445-13781-1-ND; Thickness (Max): 0.022" (0.55mm); Voltage - Rated: 50V
C17 C18 = CGB2A1X5R1A105K033BC: CAP CER 1UF 10V X5R 0402; Manufacturer: TDK Corporation; Tolerance: ±10%; Part Number: CGB2A1X5R1A105K033BC; Value: 1µF; Applications: General Purpose; Capacitance: 1µF; ComponentLink1Description: Datasheet; ComponentLink1URL: https://product.tdk.com/info/en/catalog/datasheets/mlcc_commercial_lowprofile_en.pdf?ref_disty=digikey; ComponentLink2Description: DigiKey Link; ComponentLink2URL: http://digikey.com/product-detail/en/tdk-corporation/CGB2A1X5R1A105K033BC/445-13179-1-ND/3954845; Device Package: 0402 (1005 Metric); LastUpdated: 2020-09-02 1:02:25 AM; Lifecycle Status: Active; Minimum Order: 1; Mounting Type: Surface Mount, MLCC; Operating Temperature: -55°C ~ 85°C; Package / Case: 0402 (1005 Metric); Packaging: TapeAndReel; PartId: 1796; Part Status: Active; Price: 0.02; Series: CGB; Size / Dimension: 0.039" L x 0.020" W (1.00mm x 0.50mm); Supplier 1: DigiKey; Supplier Part Number 1: 445-13179-1-ND; Temperature Coefficient: X5R; Thickness (Max): 0.013" (0.33mm); Voltage - Rated: 10V; Features: Low Profile
C19 = C1005X5R1A475K050BC: CAP CER 4.7UF 10V X5R 0402; Manufacturer: TDK Corporation; Tolerance: ±10%; Part Number: C1005X5R1A475K050BC; Value: 4.7µF; Applications: General Purpose; Capacitance: 4.7µF; ComponentLink1Description: Datasheet; ComponentLink1URL: https://product.tdk.com/info/en/catalog/datasheets/mlcc_commercial_general_en.pdf?ref_disty=digikey; ComponentLink2Description: DigiKey Link; ComponentLink2URL: http://digikey.com/product-detail/en/tdk-corporation/C1005X5R1A475K050BC/445-13820-1-ND/3955486; Device Package: 0402 (1005 Metric); LastUpdated: 2020-09-02 1:02:25 AM; Lifecycle Status: Active; Minimum Order: 1; Mounting Type: Surface Mount, MLCC; Operating Temperature: -55°C ~ 85°C; Package / Case: 0402 (1005 Metric); Packaging: TapeAndReel; PartId: 1759; Part Status: Active; Price: 0.10; Series: C; Size / Dimension: 0.039" L x 0.020" W (1.00mm x 0.50mm); Supplier 1: DigiKey; Supplier Part Number 1: 445-13820-1-ND; Temperature Coefficient: X5R; Thickness (Max): 0.022" (0.55mm); Voltage - Rated: 10V; Features: Low ESL
D4 = APHHS1005QBC/D: LED BLUE CLEAR CHIP SMD; Manufacturer: Kingbright; Configuration: Standard; Current - Test: 20mA; Lens Color: Colorless; Lens Size: 0.80mm x 0.50mm; Lens Style: Rectangle with Flat Top; Millicandela Rating: 60mcd; Viewing Angle: 120°; Voltage - Forward (Vf) (Typ): 3.3V; Wavelength - Dominant: 465nm; Wavelength - Peak: 460nm; Part Number: APHHS1005QBC/D; Color: Blue; ComponentLink1Description: Datasheet; ComponentLink1URL: http://www.kingbrightusa.com/images/catalog/SPEC/APHHS1005QBC-D.pdf; ComponentLink2Description: DigiKey Link; ComponentLink2URL: http://digikey.com/product-detail/en/kingbright/APHHS1005QBC-D/754-1504-1-ND/2263581; Device Package: 0402 (1005 Metric); Height (Max): 0.60mm; LastUpdated: 2020-09-02 1:20:21 AM; Lens Transparency: Clear; Lifecycle Status: Active; Minimum Order: 1; Mounting Type: Surface Mount; Package / Case: 0402 (1005 Metric); Packaging: TapeAndReel; PartId: 862; Part Status: Active; Price: 0.13; Series: -; Size / Dimension: 1.00mm L x 0.50mm W; Supplier 1: DigiKey; Supplier Part Number 1: 754-1504-1-ND; Supplier Device Package: Chip LED; Value: Blue
IC4 = STM32F446RET7: IC MCU 32BIT 512KB FLASH 64LQFP; Manufacturer: STMicroelectronics; Connectivity: CANbus, EBI/EMI, I²C, IrDA, LINbus, SAI, SD, SPDIF-Rx, SPI, UART/USART, USB, USB OTG; Core Processor: ARM® Cortex®-M4; Core Size: 32-Bit; Data Converters: A/D 16x12b; D/A 2x12b; Number of I/O: 50; Oscillator Type: Internal; Peripherals: Brown-out Detect/Reset, DMA, I²S, LVD, POR, PWM, WDT; Program Memory Size: 512KB (512K x 8); RAM Size: 128K x 8; Speed: 180MHz; Voltage - Supply (Vcc/Vdd): 1.7V ~ 3.6V; Part Number: STM32F446RET7; ComponentLink1Description: Datasheet; ComponentLink1URL: http://www.st.com/content/ccc/resource/technical/document/datasheet/65/cb/75/50/53/d6/48/24/DM00141306.pdf/files/DM00141306.pdf/jcr:content/translations/en.DM00141306.pdf; ComponentLink2Description: DigiKey Link; ComponentLink2URL: http://digikey.com/product-detail/en/stmicroelectronics/STM32F446RET7/497-16775-ND/6207480; Device Package: 64-LQFP; LastUpdated: 2020-08-30 9:03:14 PM; Lifecycle Status: Active; Minimum Order: 1; Mounting Type: Surface Mount; Package / Case: 64-LQFP; Packaging: Tray; PartId: 220; Price: 8.42; Program Memory Type: FLASH; Series: STM32F4; Supplier 1: DigiKey; Supplier Part Number 1: 497-16775-ND; Supplier Device Package: 64-LQFP (10x10)
J8 = 0705530106: CONN HEADER R/A 2POS 2.54MM; Manufacturer: Molex; Contact Length - Mating: 0.240" (6.10mm); Contact Length - Post: 0.130" (3.30mm); Material Flammability Rating: UL94 V-0; Number of Positions: 2; Number of Positions Loaded: All; Pitch - Mating: 0.100" (2.54mm); Shrouding: Shrouded - 4 Wall; Style: Board to Cable/Wire; Voltage Rating: 250V; Part Number: 0705530106; ComponentLink1Description: Datasheet; ComponentLink1URL: https://www.molex.com/pdm_docs/sd/705530106_sd.pdf; ComponentLink2Description: DigiKey Link; ComponentLink2URL: http://digikey.com/product-detail/en/molex/0705530106/WM4153-ND/1643386; Connector Type: Header; Contact Finish - Mating: Gold; Contact Finish - Post: Tin; Contact Finish Thickness - Mating: 30.0µin (0.76µm); Contact Material: Phosphor Bronze; Contact Shape: Square; Contact Type: Male Pin; Fastening Type: Latch Holder; Insulation Color: Black; Insulation Height: 0.215" (5.45mm); Insulation Material: Polyester, Glass Filled; LastUpdated: 2020-01-12 11:55:40 PM; Lifecycle Status: Active; Minimum Order: 1; Mounting Type: Through Hole, Right Angle; Number of Rows: 1; Operating Temperature: -40°C ~ 105°C; Packaging: Tube; PartId: 85; Part Status: Active; Price: 1.38; Series: SL 70553; Supplier 1: DigiKey; Supplier Part Number 1: WM4153-ND; Termination: Solder
J9 = 0705530003: CONN HEADER R/A 4POS 2.54MM; Manufacturer: Molex; Contact Length - Mating: 0.240" (6.10mm); Contact Length - Post: 0.130" (3.30mm); Material Flammability Rating: UL94 V-0; Number of Positions: 4; Number of Positions Loaded: All; Pitch - Mating: 0.100" (2.54mm); Shrouding: Shrouded - 4 Wall; Style: Board to Cable/Wire; Voltage Rating: 250V; Part Number: 0705530003; ComponentLink1Description: Datasheet; ComponentLink1URL: https://www.molex.com/pdm_docs/sd/705530002_sd.pdf; ComponentLink2Description: DigiKey Link; ComponentLink2URL: http://digikey.com/product-detail/en/molex/0705530003/WM4902-ND/114959; Connector Type: Header; Contact Finish - Mating: Gold; Contact Finish - Post: Tin; Contact Finish Thickness - Mating: 15.0µin (0.38µm); Contact Material: Phosphor Bronze; Contact Shape: Square; Contact Type: Male Pin; Fastening Type: Latch Holder; Insulation Color: Black; Insulation Height: 0.215" (5.45mm); Insulation Material: Polyester, Glass Filled; LastUpdated: 2020-01-12 11:56:17 PM; Lifecycle Status: Active; Minimum Order: 1; Mounting Type: Through Hole, Right Angle; Number of Rows: 1; Operating Temperature: -40°C ~ 105°C; Packaging: Tube; PartId: 87; Part Status: Active; Price: 1.05; Series: SL 70553; Supplier 1: DigiKey; Supplier Part Number 1: WM4902-ND; Termination: Solder
R9 = CRCW040210K0DHEDP: RES SMD 10K OHM 0.5% 1/16W 0402; Manufacturer: Vishay Dale; Power (Watts): 0.063W, 1/16W; Temperature Coefficient: ±50ppm/°C; Part Number: CRCW040210K0DHEDP; Value: 10 kOhms; ComponentLink1Description: Datasheet; ComponentLink1URL: http://www.vishay.com/docs/20036/dcrcwpe3.pdf; ComponentLink2Description: DigiKey Link; ComponentLink2URL: http://digikey.com/product-detail/en/vishay-dale/CRCW040210K0DHEDP/541-10KAVCT-ND/3593906; Composition: Thick Film; Device Package: 0402 (1005 Metric); Height - Seated (Max): 0.016" (0.40mm); LastUpdated: 2020-09-02 1:08:05 AM; Lifecycle Status: Active; Minimum Order: 1; Number of Terminations: 2; Operating Temperature: -55°C ~ 155°C; Package / Case: 0402 (1005 Metric); Packaging: TapeAndReel; PartId: 5057; Part Status: Active; Price: 0.03; Resistance: 10 kOhms; Series: CRCW-P; Size / Dimension: 0.039" L x 0.020" W (1.00mm x 0.50mm); Supplier 1: DigiKey; Supplier Part Number 1: 541-10KAVCT-ND; Supplier Device Package: 0402; Tolerance: ±0.5%; Features: Automotive AEC-Q200; Ratings: AEC-Q200
R10 = CRGCQ0402J220R: as R7 on sheet Power; Part Number: CRGCQ0402J220R; Value: 220 Ohms; ComponentLink1Description: Datasheet; ComponentLink1URL: https://www.te.com/commerce/DocumentDelivery/DDEController?Action=srchrtrv&DocNm=1773204-3&DocType=DS&DocLang=English; ComponentLink2Description: DigiKey Link; ComponentLink2URL: http://digikey.com/product-detail/en/te-connectivity-passive-product/CRGCQ0402J220R/A130044CT-ND/8577876; Composition: Thick Film; Device Package: 0402 (1005 Metric); Features: Automotive AEC-Q200, Moisture Resistant; Height - Seated (Max): 0.016" (0.40mm); LastUpdated: 2020-09-02 1:07:58 AM; Lifecycle Status: Active; Minimum Order: 1; Number of Terminations: 2; Operating Temperature: -55°C ~ 155°C; Package / Case: 0402 (1005 Metric); Packaging: CutTape; PartId: 8030; Part Status: Active; Price: 0.10; Ratings: AEC-Q200; Resistance: 220 Ohms; Series: CRGCQ; Size / Dimension: 0.039" L x 0.020" W (1.00mm x 0.50mm); Supplier 1: DigiKey; Supplier Part Number 1: A130044CT-ND; Supplier Device Package: 0402; Tolerance: ±5%
S1 = KXT341 LHS: SWITCH TACTILE SPST-NO 0.02A 15V; Manufacturer: C&K; Actuator Height off PCB, Vertical: 0.60mm; Actuator Orientation: Top Actuated; Actuator Type: Standard; Contact Rating @ Voltage: 0.02A @ 15VDC; Illumination: Non-Illuminated; Operating Force: 330gf; Outline: 3.00mm x 2.00mm; Switch Function: Off-Mom; Part Number: KXT341 LHS; Circuit: SPST-NO; ComponentLink1Description: Datasheet; ComponentLink1URL: https://dznh3ojzb2azq.cloudfront.net/products/Tactile/KXT3/documents/datasheet.pdf; ComponentLink2Description: DigiKey Link; ComponentLink2URL: http://digikey.com/product-detail/en/c-k/KXT341-LHS/CKN10781CT-ND/6607324; LastUpdated: 2020-09-02 1:27:07 AM; Lifecycle Status: Active; Minimum Order: 1; Mounting Type: Surface Mount; Operating Temperature: -40°C ~ 85°C; Packaging: TapeAndReel; Part Status: Active; Price: 0.14; Series: KXT3; Supplier 1: DigiKey; Supplier Part Number 1: CKN10781CT-ND; Termination Style: SMD (SMT) Tab
Y1 = NX3225GD-8MHZ-STD-CRA-3: CRYSTAL 8.0000MHZ 8PF SMD; Manufacturer: NDK America, Inc.; ESR (Equivalent Series Resistance): 500 Ohms; Frequency Stability: ±150ppm; Frequency Tolerance: ±50ppm; Operating Mode: Fundamental; Part Number: NX3225GD-8MHZ-STD-CRA-3; ComponentLink1Description: Datasheet; ComponentLink1URL: http://www.ndk.com/images/products/catalog/c_NX3225GD-STD-CRA-3_e.pdf; ComponentLink2Description: DigiKey Link; ComponentLink2URL: http://digikey.com/product-detail/en/ndk-america-inc/NX3225GD-8MHZ-STD-CRA-3/644-1178-1-ND/3125567; Frequency: 8MHz; Height - Seated (Max): 0.039" (1.00mm); LastUpdated: 2020-09-02 1:25:56 AM; Lifecycle Status: Active; Load Capacitance: 8pF; Minimum Order: 1; Mounting Type: Surface Mount; Operating Temperature: -40°C ~ 150°C; Package / Case: 2-SMD, No Lead; Packaging: TapeAndReel; PartId: 744; Part Status: Active; Price: 0.48; Ratings: AEC-Q200; Series: NX3225GD; Size / Dimension: 0.126" L x 0.098" W (3.20mm x 2.50mm); Supplier 1: DigiKey; Supplier Part Number 1: 644-1178-1-ND; Type: MHz Crystal; Value: 8MHz

## Sheet CAN.SchDoc: =DocumentName
size A4; Organization: Queen's Formula SAE; Address1: 130 Stuart St, Kingston; Address2: Ontario; Address3: Canada; Address4: K7L 2V9; DocumentNumber: 1; Revision: 0; SheetNumber: 1; SheetTotal: 1
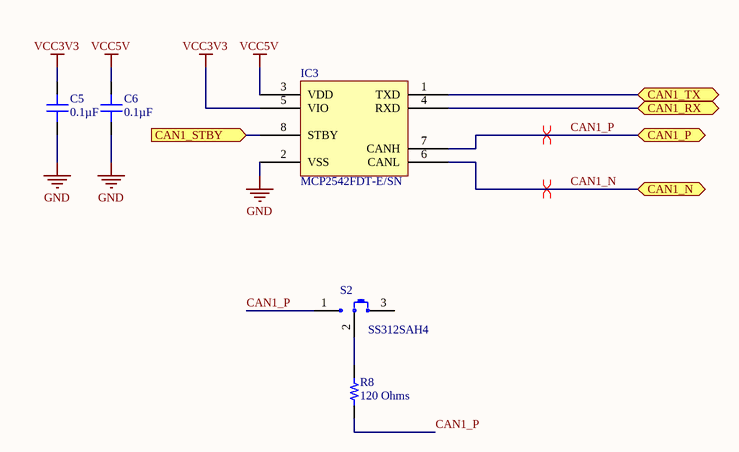
[diagram p3: CAN.SchDoc]

### Parts
C5  0.1µF  [CAP 0201_0603]
C6  0.1µF  [CAP 0201_0603]
IC3  MCP2542FDT-E/SN  [MICROCHIP SOIC-8 150MIL WIDE]
R8  120 Ohms  [RES 0402_1005]
S2  SS312SAH4  [NKK SS312SAH4]

### Ports
CAN1_N (bidir), CAN1_P (bidir), CAN1_RX (bidir), CAN1_STBY (in), CAN1_TX (bidir)

### Nets
GND: C5.1 C6.1 IC3.2(VSS)
VCC3V3: C5.2 IC3.5(VIO)
VCC5V: C6.2 IC3.3(VDD)
CAN1_N: IC3.6(CANL) ; port CAN1_N
CAN1_P: IC3.7(CANH) R8.1 S2.1 ; port CAN1_P
CAN1_RX: IC3.4(RXD) ; port CAN1_RX
CAN1_STBY: IC3.8(STBY) ; port CAN1_STBY
CAN1_TX: IC3.1(TXD) ; port CAN1_TX
NetR8_2: R8.2 S2.2(COM)

Not connected (* = marked no-connect by the designer): S2 3

### Layout directives
differential pair: CAN1_N, CAN1_P

### Notes on the sheet
- Title
- Size:
- Date:
- A4
- Number:
- Time:
- Revision:
- Sheet
- of
- File:

### Library data of the parts
C5 C6 = EMK063BJ104KP-F: CAP CER 0.1UF 16V X5R 0201; Manufacturer: Taiyo Yuden; Tolerance: ±10%; Part Number: EMK063BJ104KP-F; Value: 0.1µF; Applications: General Purpose; Capacitance: 0.1µF; ComponentLink1Description: Datasheet; ComponentLink1URL: https://ds.yuden.co.jp/TYCOMPAS/ut/detail?pn=EMK063BJ104KP-F  &u=M; ComponentLink2Description: DigiKey Link; ComponentLink2URL: http://digikey.com/product-detail/en/taiyo-yuden/EMK063BJ104KP-F/587-5833-1-ND/7674954; Device Package: 0201 (0603 Metric); LastUpdated: 2020-09-02 1:00:18 AM; Lifecycle Status: Active; Minimum Order: 1; Mounting Type: Surface Mount, MLCC; Operating Temperature: -55°C ~ 85°C; Package / Case: 0201 (0603 Metric); Packaging: TapeAndReel; PartId: 12; Part Status: Active; Price: 0.02; Series: M; Size / Dimension: 0.024" L x 0.012" W (0.60mm x 0.30mm); Supplier 1: DigiKey; Supplier Part Number 1: 587-5833-1-ND; Temperature Coefficient: X5R; Thickness (Max): 0.013" (0.33mm); Voltage - Rated: 16V
IC3 = MCP2542FDT-E/SN: IC TRANSCEIVER 1/1 8SOIC; Manufacturer: Microchip Technology; Data Rate: 8Mbps; Protocol: CANbus; Receiver Hysteresis: 200mV; Voltage - Supply: 4.5V ~ 5.5V; Part Number: MCP2542FDT-E/SN; ComponentLink1Description: Datasheet; ComponentLink1URL: http://www.microchip.com/mymicrochip/filehandler.aspx?ddocname=en585412; ComponentLink2Description: DigiKey Link; ComponentLink2URL: http://digikey.com/product-detail/en/microchip-technology/MCP2542FDT-E-SN/MCP2542FDT-E-SNCT-ND/9642863; Device Package: 8-SOIC (0.154", 3.90mm Width); LastUpdated: 2020-05-24 11:07:13 PM; Lifecycle Status: Active; Minimum Order: 1; Mounting Type: Surface Mount; Number of Drivers/Receivers: 1/1; Operating Temperature: -40°C ~ 125°C; Package / Case: 8-SOIC (0.154", 3.90mm Width); Packaging: TapeAndReel; Part Status: Active; Price: 0.59; Series: -; Supplier 1: DigiKey; Supplier Part Number 1: MCP2542FDT-E/SNCT-ND; Supplier Device Package: 8-SOIC; Type: Transceiver
R8 = RC0402JR-07120RL: RES SMD 120 OHM 5% 1/16W 0402; Manufacturer: Yageo; Power (Watts): 0.063W, 1/16W; Temperature Coefficient: ±100ppm/°C; Part Number: RC0402JR-07120RL; Value: 120 Ohms; ComponentLink1Description: Datasheet; ComponentLink1URL: https://www.yageo.com/upload/media/product/productsearch/datasheet/rchip/PYu-RC_Group_51_RoHS_L_10.pdf; ComponentLink2Description: DigiKey Link; ComponentLink2URL: http://digikey.com/product-detail/en/yageo/RC0402JR-07120RL/311-120JRCT-ND/2827967; Composition: Thick Film; Device Package: 0402 (1005 Metric); Features: Moisture Resistant; Height - Seated (Max): 0.016" (0.40mm); LastUpdated: 2020-09-02 1:08:05 AM; Lifecycle Status: Active; Minimum Order: 1; Number of Terminations: 2; Operating Temperature: -55°C ~ 155°C; Package / Case: 0402 (1005 Metric); Packaging: CutTape; PartId: 4797; Part Status: Active; Price: 0.10; Resistance: 120 Ohms; Series: RC; Size / Dimension: 0.039" L x 0.020" W (1.00mm x 0.50mm); Supplier 1: DigiKey; Supplier Part Number 1: 311-120JRCT-ND; Supplier Device Package: 0402; Tolerance: ±5%
S2 = SS312SAH4: SWITCH SLIDE SPDT 0.4VA 28V; Manufacturer: NKK Switches; Actuator Length: 2.00mm; Actuator Type: Standard; Contact Timing: Shorting (MBB); Current Rating (Amps): 0.4VA (AC/DC); Switch Function: On-On; Part Number: SS312SAH4; Circuit: SPDT; ComponentLink1Description: Datasheet; ComponentLink1URL: http://www.nkkswitches.com/pdf/SS3surfaceMount-1.pdf; ComponentLink2Description: DigiKey Link; ComponentLink2URL: http://digikey.com/product-detail/en/nkk-switches/SS312SAH4/360-3250-ND/1052031; Contact Finish: Gold; Contact Material: Phosphor Bronze; LastUpdated: 2020-01-04 7:15:23 PM; Lifecycle Status: Active; Minimum Order: 1; Mounting Type: Surface Mount, Right Angle; Operating Temperature: -25°C ~ 85°C; Packaging: Tray; PartId: 2; Part Status: Active; Price: 3.02; Series: SS3; Supplier 1: DigiKey; Supplier Part Number 1: 360-3250-ND; Termination Style: Gull Wing; Voltage Rating - AC: 28V; Voltage Rating - DC: 28V

## Sheet Connectors.SchDoc: =DocumentName
size A4; Organization: Queen's Formula SAE; Address1: 130 Stuart St, Kingston; Address2: Ontario; Address3: Canada; Address4: K7L 2V9; DocumentNumber: 1; Revision: 0; SheetNumber: 1; SheetTotal: 1
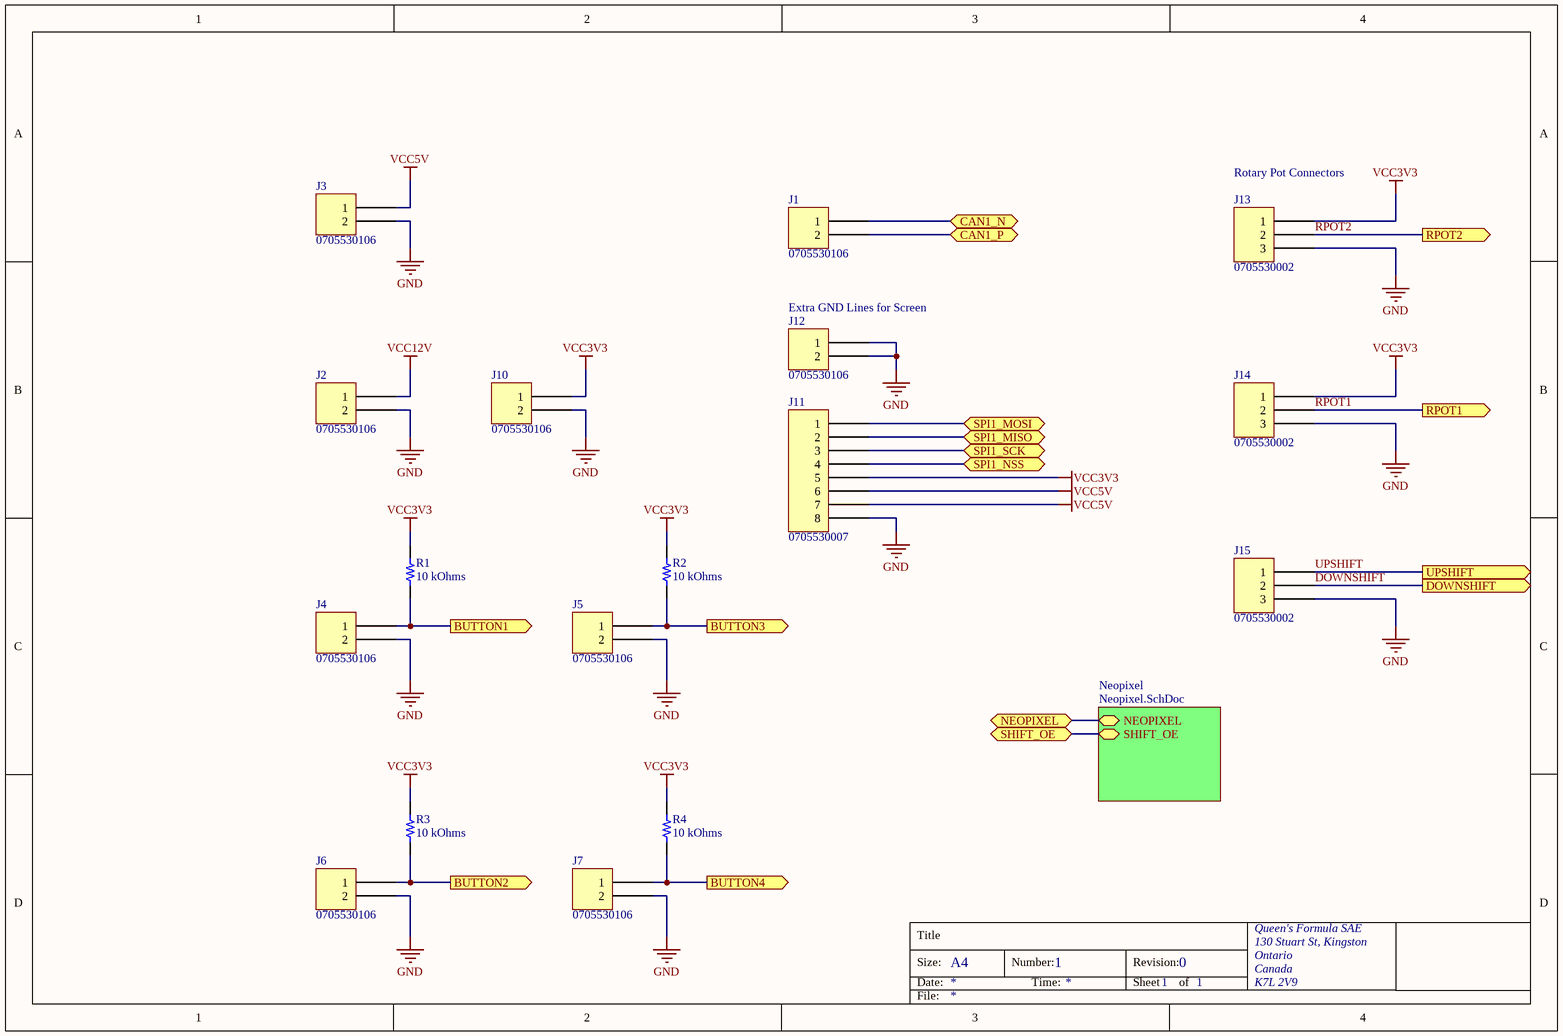
[diagram p4: Connectors.SchDoc]

### Parts
J1  0705530106  [MOLEX SDA-70553-2PIN]
J2  0705530106  [MOLEX SDA-70553-2PIN]
J3  0705530106  [MOLEX SDA-70553-2PIN]
J4  0705530106  [MOLEX SDA-70553-2PIN]
J5  0705530106  [MOLEX SDA-70553-2PIN]
J6  0705530106  [MOLEX SDA-70553-2PIN]
J7  0705530106  [MOLEX SDA-70553-2PIN]
J10  0705530106  [MOLEX SDA-70553-2PIN]
J11  0705530007  [MOLEX SDA-70553-8PIN]
J12  0705530106  [MOLEX SDA-70553-2PIN]
J13  0705530002  [MOLEX SDA-70553-3PIN]
J14  0705530002  [MOLEX SDA-70553-3PIN]
J15  0705530002  [MOLEX SDA-70553-3PIN]
R1  10 kOhms  [RES 0402_1005]
R2  10 kOhms  [RES 0402_1005]
R3  10 kOhms  [RES 0402_1005]
R4  10 kOhms  [RES 0402_1005]

### Sub-sheets
Neopixel = Neopixel.SchDoc: NEOPIXEL (bidir), SHIFT_OE (bidir)

### Ports
BUTTON1 (out), BUTTON2 (out), BUTTON3 (out), BUTTON4 (out), CAN1_N (bidir), CAN1_P (bidir), DOWNSHIFT (out), NEOPIXEL (bidir), RPOT1 (out), RPOT2 (out), SHIFT_OE (bidir), SPI1_MISO (bidir), SPI1_MOSI (bidir), SPI1_NSS (bidir), SPI1_SCK (bidir), UPSHIFT (out)

### Nets
GND: J2.2 J3.2 J4.2 J5.2 J6.2 J7.2 J10.2 J11.8 J12.1 J12.2 J13.3 J14.3 J15.3
VCC3V3: J10.1 J11.5 J13.1 J14.1 R1.2 R2.2 R3.2 R4.2
VCC5V: J3.1 J11.6 J11.7
VCC12V: J2.1
BUTTON1: J4.1 R1.1 ; port BUTTON1
BUTTON2: J6.1 R3.1 ; port BUTTON2
BUTTON3: J5.1 R2.1 ; port BUTTON3
BUTTON4: J7.1 R4.1 ; port BUTTON4
CAN1_N: J1.1 ; port CAN1_N
CAN1_P: J1.2 ; port CAN1_P
DOWNSHIFT: J15.2 ; port DOWNSHIFT
NEOPIXEL: port NEOPIXEL, sheet Neopixel/NEOPIXEL
RPOT1: J14.2 ; port RPOT1
RPOT2: J13.2 ; port RPOT2
SHIFT_OE: port SHIFT_OE, sheet Neopixel/SHIFT_OE
SPI1_MISO: J11.2 ; port SPI1_MISO
SPI1_MOSI: J11.1 ; port SPI1_MOSI
SPI1_NSS: J11.4 ; port SPI1_NSS
SPI1_SCK: J11.3 ; port SPI1_SCK
UPSHIFT: J15.1 ; port UPSHIFT

### Notes on the sheet
- (near J13) Rotary Pot Connectors
- (near J12) Extra GND Lines for Screen
- Title
- Size:
- Date:
- A4
- Number:
- Time:
- Revision:
- Sheet
- of
- File:

### Library data of the parts
J1-J7 J10 J12 = 0705530106: as J8 on sheet MCU; Part Number: 0705530106; ComponentLink1Description: Datasheet; ComponentLink1URL: https://www.molex.com/pdm_docs/sd/705530106_sd.pdf; ComponentLink2Description: DigiKey Link; ComponentLink2URL: http://digikey.com/product-detail/en/molex/0705530106/WM4153-ND/1643386; Connector Type: Header; Contact Finish - Mating: Gold; Contact Finish - Post: Tin; Contact Finish Thickness - Mating: 30.0µin (0.76µm); Contact Material: Phosphor Bronze; Contact Shape: Square; Contact Type: Male Pin; Fastening Type: Latch Holder; Insulation Color: Black; Insulation Height: 0.215" (5.45mm); Insulation Material: Polyester, Glass Filled; LastUpdated: 2020-01-12 11:55:40 PM; Lifecycle Status: Active; Minimum Order: 1; Mounting Type: Through Hole, Right Angle; Number of Rows: 1; Operating Temperature: -40°C ~ 105°C; Packaging: Tube; PartId: 85; Part Status: Active; Price: 1.38; Series: SL 70553; Supplier 1: DigiKey; Supplier Part Number 1: WM4153-ND; Termination: Solder
J11 = 0705530007: CONN HEADER R/A 8POS 2.54MM; Part Number: 0705530007
J13 = 0705530002: CONN HEADER R/A 3POS 2.54MM; Part Number: 0705530002
J14 J15 = 0705530002: CONN HEADER R/A 3POS 2.54MM; Manufacturer: Molex; Contact Length - Mating: 0.240" (6.10mm); Contact Length - Post: 0.130" (3.30mm); Material Flammability Rating: UL94 V-0; Number of Positions: 3; Number of Positions Loaded: All; Pitch - Mating: 0.100" (2.54mm); Shrouding: Shrouded - 4 Wall; Style: Board to Cable/Wire; Voltage Rating: 250V; Part Number: 0705530002; ComponentLink1Description: Datasheet; ComponentLink1URL: https://www.molex.com/pdm_docs/sd/705530002_sd.pdf; ComponentLink2Description: DigiKey Link; ComponentLink2URL: http://digikey.com/product-detail/en/molex/0705530002/WM4901-ND/114955; Connector Type: Header; Contact Finish - Mating: Gold; Contact Finish - Post: Tin; Contact Finish Thickness - Mating: 15.0µin (0.38µm); Contact Material: Phosphor Bronze; Contact Shape: Square; Contact Type: Male Pin; Fastening Type: Latch Holder; Insulation Color: Black; Insulation Height: 0.215" (5.45mm); Insulation Material: Polyester, Glass Filled; LastUpdated: 2020-01-12 11:55:56 PM; Lifecycle Status: Active; Minimum Order: 1; Mounting Type: Through Hole, Right Angle; Number of Rows: 1; Operating Temperature: -40°C ~ 105°C; Packaging: Tube; PartId: 86; Part Status: Active; Price: 1.02; Series: SL 70553; Supplier 1: DigiKey; Supplier Part Number 1: WM4901-ND; Termination: Solder
R1-R4 = CPF0402B10KE1: RES SMD 10K OHM 0.1% 1/16W 0402; Manufacturer: TE Connectivity Passive Product; Power (Watts): 0.063W, 1/16W; Temperature Coefficient: ±25ppm/°C; Part Number: CPF0402B10KE1; Value: 10 kOhms; ComponentLink1Description: Datasheet; ComponentLink1URL: https://www.te.com/commerce/DocumentDelivery/DDEController?Action=srchrtrv&DocNm=1773200&DocType=DS&DocLang=English; ComponentLink2Description: DigiKey Link; ComponentLink2URL: http://digikey.com/product-detail/en/te-connectivity-passive-product/CPF0402B10KE1/A102579CT-ND/2729112; Composition: Thin Film; Device Package: 0402 (1005 Metric); Height - Seated (Max): 0.014" (0.35mm); LastUpdated: 2020-09-02 1:07:41 AM; Lifecycle Status: Active; Minimum Order: 1; Number of Terminations: 2; Operating Temperature: -55°C ~ 155°C; Package / Case: 0402 (1005 Metric); Packaging: TapeAndReel; PartId: 15889; Part Status: Active; Price: 0.13; Resistance: 10 kOhms; Series: CPF, Neohm; Size / Dimension: 0.039" L x 0.020" W (1.00mm x 0.50mm); Supplier 1: DigiKey; Supplier Part Number 1: A102579CT-ND; Supplier Device Package: 0402; Tolerance: ±0.1%